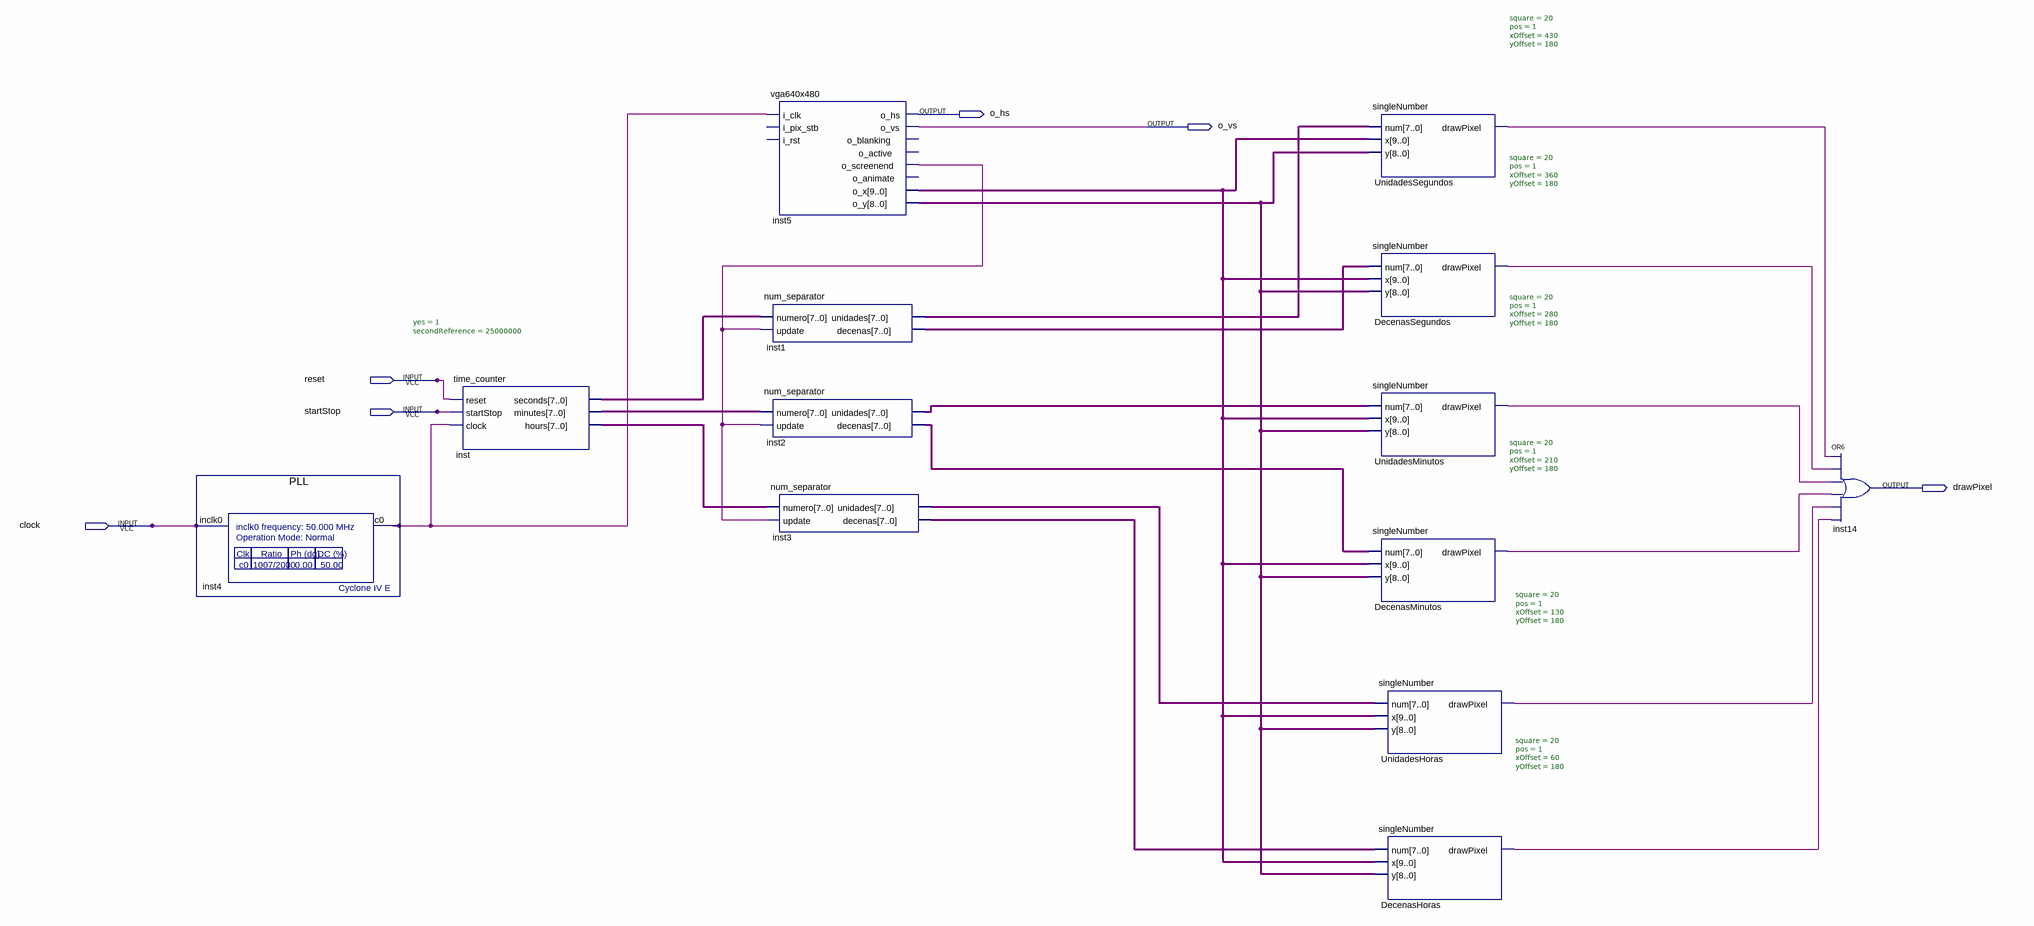
[diagram p0: schematic sheet]
// Quartus schematic FPGA.bdf as structural Verilog: 13 symbols, 6 pins
module FPGA (
  input  reset,
  input  startStop,
  input  clock,
  output o_hs,
  output o_vs,
  output drawPixel
);

  wire DecenasHoras_drawpixel, DecenasMinutos_drawpixel, DecenasSegundos_drawpixel, inst4_c0,
       inst5_o_screenend, UnidadesHoras_drawpixel, UnidadesMinutos_drawpixel, UnidadesSegundos_drawpixel;
  wire [7:0] inst1_decenas, inst1_unidades, inst2_decenas, inst2_unidades, inst3_decenas, inst3_unidades,
       inst_hours, inst_minutes, inst_seconds;
  wire [8:0] inst5_o_y;
  wire [9:0] inst5_o_x;

  PLL inst4 (.inclk0(clock), .c0(inst4_c0));
  time_counter #(.yes(1), .secondReference(25000000)) inst (
    .reset(reset), .startStop(startStop), .clock(inst4_c0), .seconds(inst_seconds), .minutes(inst_minutes),
    .hours(inst_hours));
  vga640x480 inst5 (
    .i_clk(inst4_c0), .o_hs(o_hs), .o_vs(o_vs), .o_screenend(inst5_o_screenend), .o_x(inst5_o_x),
    .o_y(inst5_o_y));  // open: i_pix_stb, i_rst, o_blanking, o_active, o_animate
  num_separator inst1 (
    .numero(inst_seconds), .update(inst5_o_screenend), .unidades(inst1_unidades), .decenas(inst1_decenas));
  num_separator inst2 (
    .numero(inst_minutes), .update(inst5_o_screenend), .unidades(inst2_unidades), .decenas(inst2_decenas));
  num_separator inst3 (
    .numero(inst_hours), .update(inst5_o_screenend), .unidades(inst3_unidades), .decenas(inst3_decenas));
  singleNumber #(.square(20), .pos(1), .xOffset(430), .yOffset(180)) UnidadesSegundos (
    .num(inst1_unidades), .x(inst5_o_x), .y(inst5_o_y), .drawPixel(UnidadesSegundos_drawpixel));
  singleNumber #(.square(20), .pos(1), .xOffset(360), .yOffset(180)) DecenasSegundos (
    .num(inst1_decenas), .x(inst5_o_x), .y(inst5_o_y), .drawPixel(DecenasSegundos_drawpixel));
  singleNumber #(.square(20), .pos(1), .xOffset(280), .yOffset(180)) UnidadesMinutos (
    .num(inst2_unidades), .x(inst5_o_x), .y(inst5_o_y), .drawPixel(UnidadesMinutos_drawpixel));
  singleNumber #(.square(20), .pos(1), .xOffset(210), .yOffset(180)) DecenasMinutos (
    .num(inst2_decenas), .x(inst5_o_x), .y(inst5_o_y), .drawPixel(DecenasMinutos_drawpixel));
  singleNumber #(.square(20), .pos(1), .xOffset(130), .yOffset(180)) UnidadesHoras (
    .num(inst3_unidades), .x(inst5_o_x), .y(inst5_o_y), .drawPixel(UnidadesHoras_drawpixel));
  singleNumber #(.square(20), .pos(1), .xOffset(60), .yOffset(180)) DecenasHoras (
    .num(inst3_decenas), .x(inst5_o_x), .y(inst5_o_y), .drawPixel(DecenasHoras_drawpixel));
  or inst14 (drawPixel, UnidadesSegundos_drawpixel, DecenasSegundos_drawpixel, UnidadesMinutos_drawpixel, DecenasMinutos_drawpixel, UnidadesHoras_drawpixel, DecenasHoras_drawpixel);
endmodule
